# Altium schematic sheet FPGA_Banks_GTH.SchDoc: =ProjectName
size 420 x 297 mm; Author: T.P.; CompanyName: WUT; DrawnBy: T.P.; Organization: WUT ISE; Address1: Warsaw Univeristy of Technology; Address2: Nowowiejska 15/19; DocumentNumber: 10; Revision: 0.9; SheetNumber: 10; SheetTotal: 36; EDA_Number: ARTIQ; Projet: ARTIQ/SINARA; ModifiedBy: -; CreateDate: XX/XX/XXXX; CheckedDate: -; Title2: FPGA_Banks_GTH.SchDoc; DivGrp: ISE; Designer: G.K. and T.P.; ModifiedDate: -; ProjectName: ADC/DAC MEZZANINE
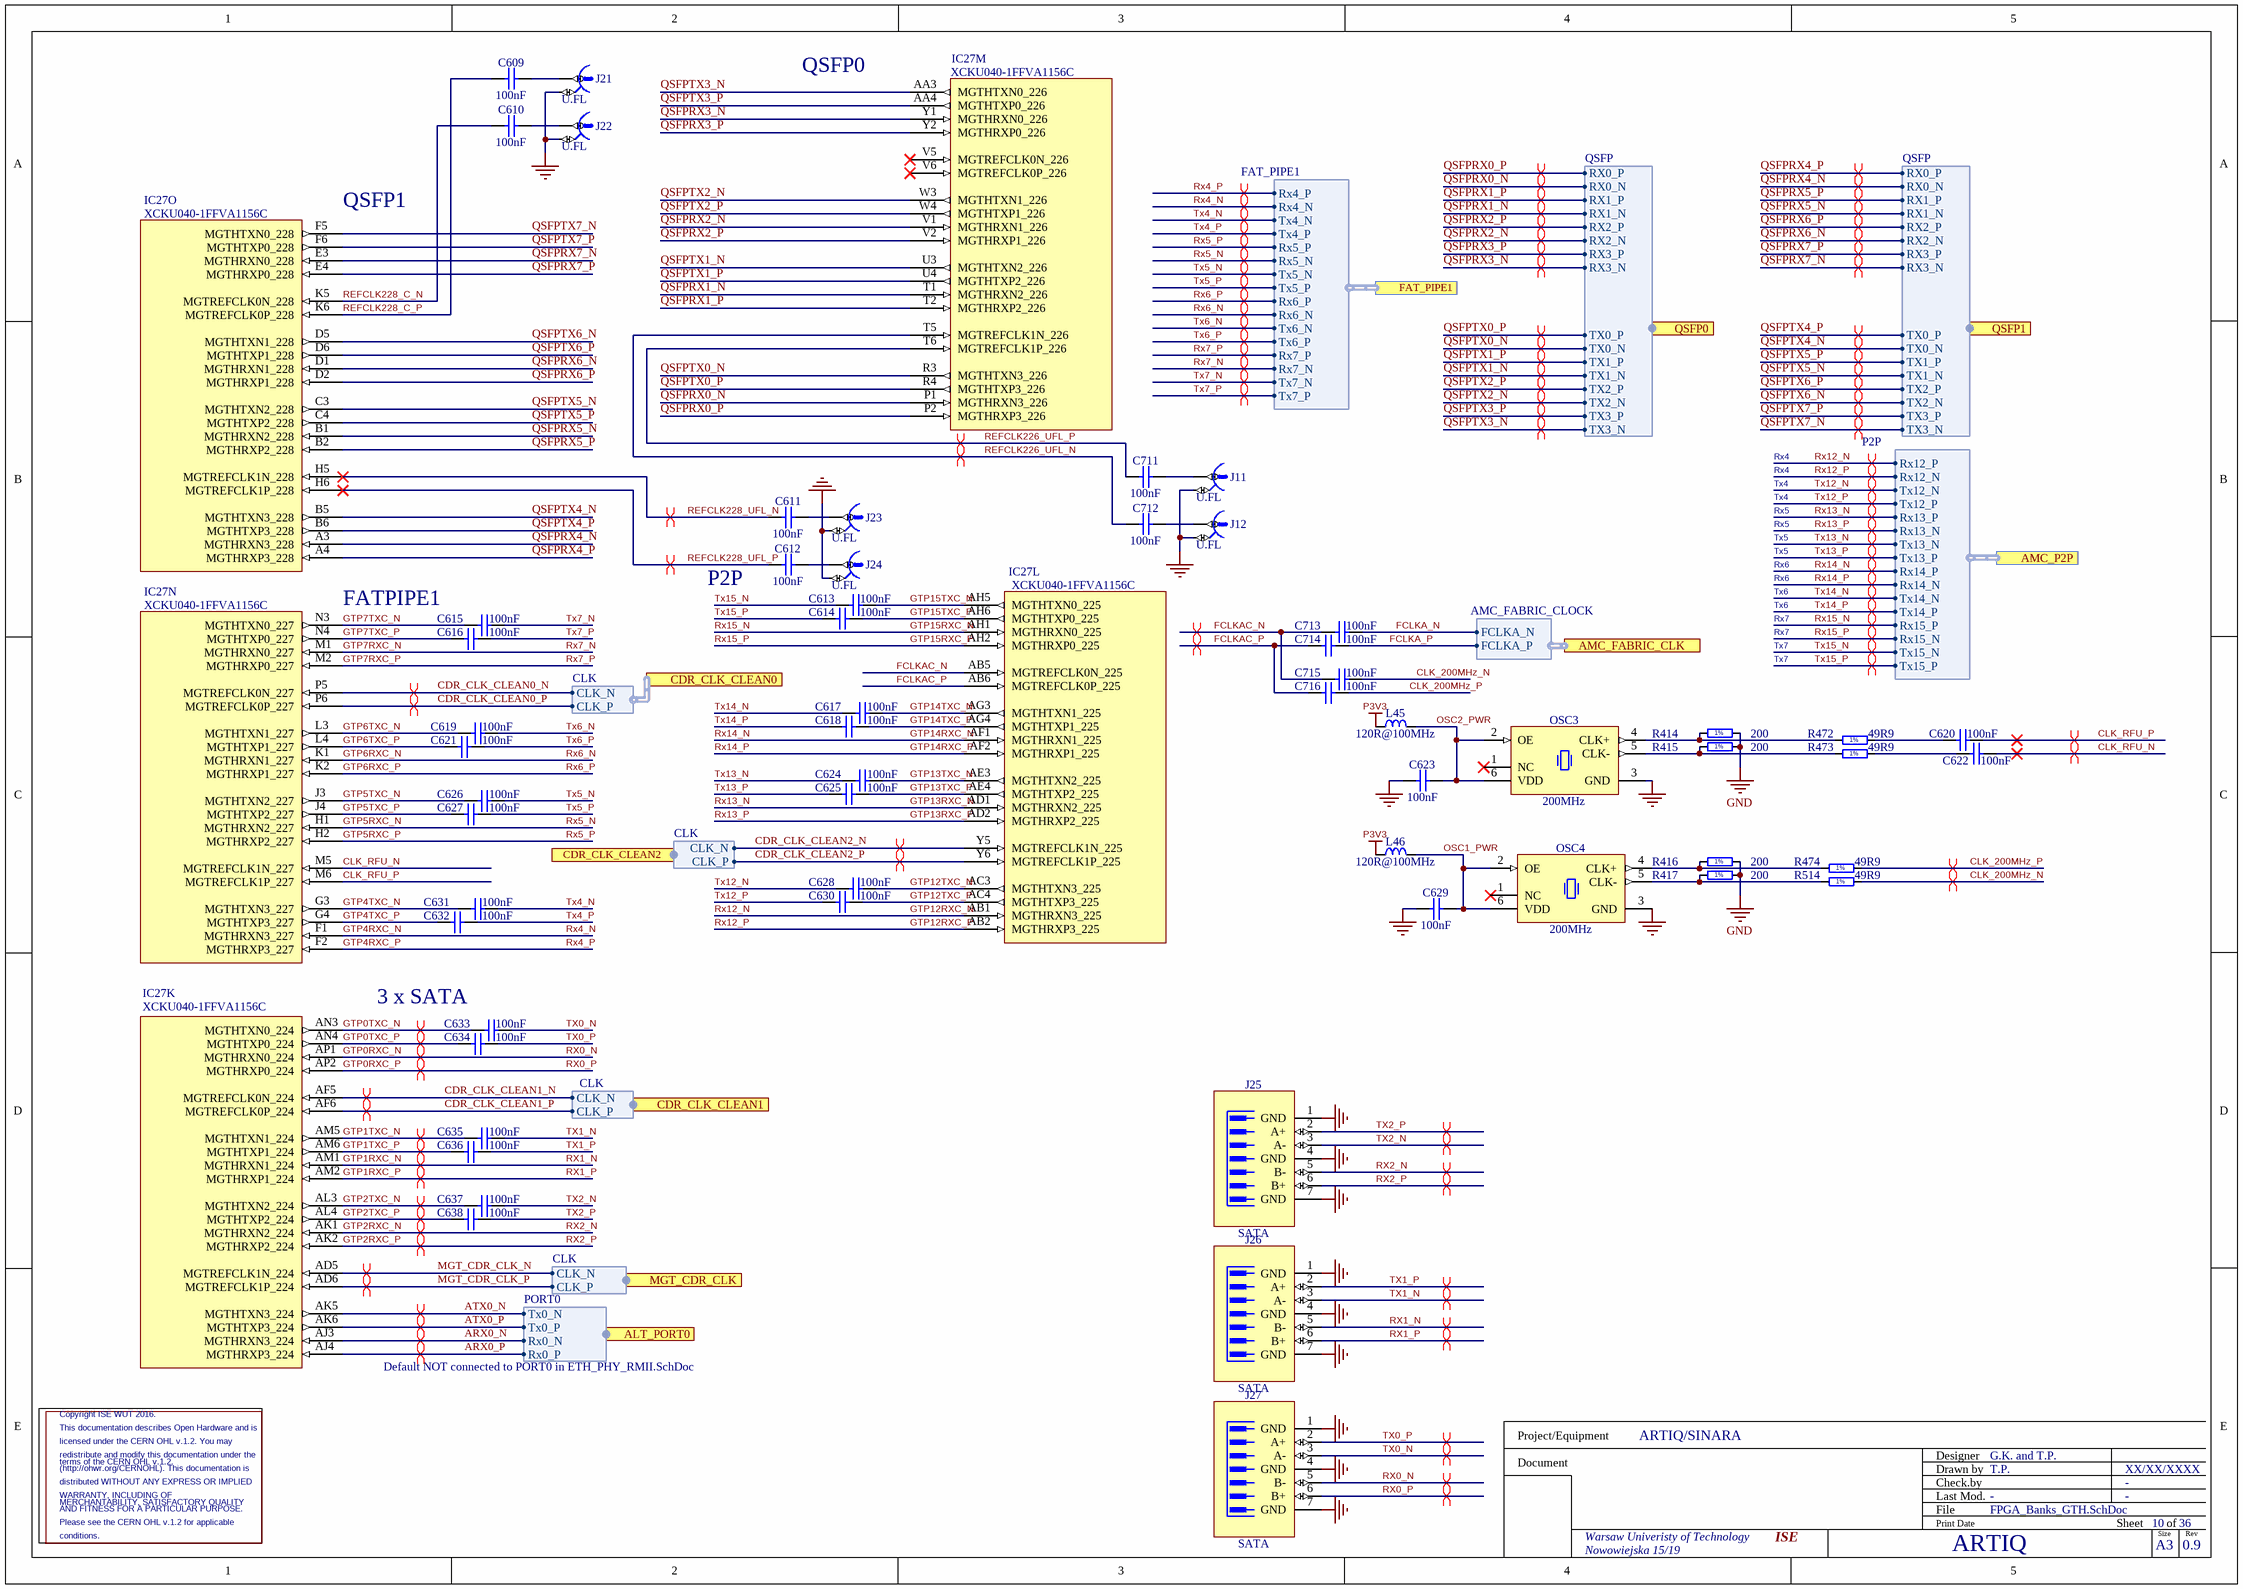
[diagram p0: FPGA_Banks_GTH.SchDoc]

## Parts
C609  100nF  [CAPC0603X33N]
C610  100nF  [CAPC0603X33N]
C611  100nF  [CAPC0603X33N]
C612  100nF  [CAPC0603X33N]
C613  100nF  [CAPC0603X33N]
C614  100nF  [CAPC0603X33N]
C615  100nF  [CAPC0603X33N]
C616  100nF  [CAPC0603X33N]
C617  100nF  [CAPC0603X33N]
C618  100nF  [CAPC0603X33N]
C619  100nF  [CAPC0603X33N]
C620  100nF  [CAPC0603X33N]
C621  100nF  [CAPC0603X33N]
C622  100nF  [CAPC0603X33N]
C623  100nF  [CAPC0603X33N]
C624  100nF  [CAPC0603X33N]
C625  100nF  [CAPC0603X33N]
C626  100nF  [CAPC0603X33N]
C627  100nF  [CAPC0603X33N]
C628  100nF  [CAPC0603X33N]
C629  100nF  [CAPC0603X33N]
C630  100nF  [CAPC0603X33N]
C631  100nF  [CAPC0603X33N]
C632  100nF  [CAPC0603X33N]
C633  100nF  [CAPC0603X33N]
C634  100nF  [CAPC0603X33N]
C635  100nF  [CAPC0603X33N]
C636  100nF  [CAPC0603X33N]
C637  100nF  [CAPC0603X33N]
C638  100nF  [CAPC0603X33N]
C711  100nF  [CAPC0603X33N]
C712  100nF  [CAPC0603X33N]
C713  100nF  [CAPC0603X33N]
C714  100nF  [CAPC0603X33N]
C715  100nF  [CAPC0603X33N]
C716  100nF  [CAPC0603X33N]
IC27  XCKU040-1FFVA1156C  [BGA1156C100P34X34_3500X3500X350]  (parts K,L,M,N,O of 22)
J11  U.FL  [HIROSE_U.FL-R-SMT-1(10)]
J12  U.FL  [HIROSE_U.FL-R-SMT-1(10)]
J21  U.FL  [HIROSE_U.FL-R-SMT-1(10)]
J22  U.FL  [HIROSE_U.FL-R-SMT-1(10)]
J23  U.FL  [HIROSE_U.FL-R-SMT-1(10)]
J24  U.FL  [HIROSE_U.FL-R-SMT-1(10)]
J25  SATA  [MOLEX_67800-5005]
J26  SATA  [MOLEX_67800-5005]
J27  SATA  [MOLEX_67800-5005]
L45  120R@100MHz  [INDC1005X55N]
L46  120R@100MHz  [INDC1005X55N]
OSC3  200MHz  [OSC_SILICON-LAB_SI510-6N(5X7)]
OSC4  200MHz  [OSC_SILICON-LAB_SI510-6N(5X7)]
R414  200  [RESC1005X40N]
R415  200  [RESC1005X40N]
R416  200  [RESC1005X40N]
R417  200  [RESC1005X40N]
R472  49R9  [RESC1005X40N]
R473  49R9  [RESC1005X40N]
R474  49R9  [RESC1005X40N]
R514  49R9  [RESC1005X40N]

## Ports
ALT_PORT0 (harness PORT0), AMC_FABRIC_CLK (harness AMC_FABRIC_CLOCK), AMC_P2P (harness P2P), CDR_CLK_CLEAN0 (harness CLK), CDR_CLK_CLEAN1 (harness CLK), CDR_CLK_CLEAN2 (harness CLK), FAT_PIPE1 (harness FAT_PIPE1), MGT_CDR_CLK (harness CLK), QSFP0 (harness QSFP), QSFP1 (harness QSFP)

## Harnesses
CLK: CLK_N, CLK_P
FAT_PIPE1: Rx4_P, Rx4_N, Tx4_N, Tx4_P, Rx5_P, Rx5_N, Tx5_N, Tx5_P, Rx6_P, Rx6_N, Tx6_N, Tx6_P, Rx7_P, Rx7_N, Tx7_N, Tx7_P
P2P: Rx12_P, Rx12_N, Tx12_N, Tx12_P, Rx13_P, Rx13_N, Tx13_N, Tx13_P, Rx14_P, Rx14_N, Tx14_N, Tx14_P, Rx15_P, Rx15_N, Tx15_N, Tx15_P
QSFP: RX0_P, RX0_N, RX1_P, RX1_N, RX2_P, RX2_N, RX3_P, RX3_N, TX0_P, TX0_N, TX1_P, TX1_N, TX2_P, TX2_N, TX3_P, TX3_N
PORT0: Rx0_P, Rx0_N, Tx0_N, Tx0_P
AMC_FABRIC_CLOCK: FCLKA_N, FCLKA_P

## Nets
GND: C623.1 C629.1 J11.2 J12.2 J21.2 J22.2 J23.2 J24.2 J25.1(GND) J25.4(GND) J25.7(GND) J26.1(GND) J26.4(GND) J26.7(GND) J27.1(GND) J27.4(GND) J27.7(GND) OSC3.3(GND) OSC4.3(GND) R414.2 R415.2 R416.2 R417.2
P3V3: L45.2 L46.2
ARX0_N: IC27.AJ3(MGTHRXN3_224) ; port ALT_PORT0.Rx0_N
ARX0_P: IC27.AJ4(MGTHRXP3_224) ; port ALT_PORT0.Rx0_P
ATX0_N: IC27.AK5(MGTHTXN3_224) ; port ALT_PORT0.Tx0_N
ATX0_P: IC27.AK6(MGTHTXP3_224) ; port ALT_PORT0.Tx0_P
CDR_CLK_CLEAN0_N: IC27.P5(MGTREFCLK0N_227) ; port CDR_CLK_CLEAN0.CLK_N
CDR_CLK_CLEAN0_P: IC27.P6(MGTREFCLK0P_227) ; port CDR_CLK_CLEAN0.CLK_P
CDR_CLK_CLEAN1_N: IC27.AF5(MGTREFCLK0N_224) ; port CDR_CLK_CLEAN1.CLK_N
CDR_CLK_CLEAN1_P: IC27.AF6(MGTREFCLK0P_224) ; port CDR_CLK_CLEAN1.CLK_P
CDR_CLK_CLEAN2_N: IC27.Y5(MGTREFCLK1N_225) ; port CDR_CLK_CLEAN2.CLK_N
CDR_CLK_CLEAN2_P: IC27.Y6(MGTREFCLK1P_225) ; port CDR_CLK_CLEAN2.CLK_P
CLK_200MHz_N: C715.2 R514.2
CLK_200MHz_P: C716.2 R474.2
CLK_RFU_N: C622.2 IC27.M5(MGTREFCLK1N_227)
CLK_RFU_P: C620.2 IC27.M6(MGTREFCLK1P_227)
FCLKA_N: C713.2 ; port AMC_FABRIC_CLK.FCLKA_N
FCLKA_P: C714.2 ; port AMC_FABRIC_CLK.FCLKA_P
FCLKAC_N: C713.1 C715.1 IC27.AB5(MGTREFCLK0N_225)
FCLKAC_P: C714.1 C716.1 IC27.AB6(MGTREFCLK0P_225)
GTP0RXC_N: IC27.AP1(MGTHRXN0_224) J27.5(B-)  [also labelled RX0_N]
GTP0RXC_P: IC27.AP2(MGTHRXP0_224) J27.6(B+)  [also labelled RX0_P]
GTP0TXC_N: C633.1 IC27.AN3(MGTHTXN0_224)
GTP0TXC_P: C634.1 IC27.AN4(MGTHTXP0_224)
GTP1RXC_N: IC27.AM1(MGTHRXN1_224) J26.5(B-)  [also labelled RX1_N]
GTP1RXC_P: IC27.AM2(MGTHRXP1_224) J26.6(B+)  [also labelled RX1_P]
GTP1TXC_N: C635.1 IC27.AM5(MGTHTXN1_224)
GTP1TXC_P: C636.1 IC27.AM6(MGTHTXP1_224)
GTP2RXC_N: IC27.AK1(MGTHRXN2_224) J25.5(B-)  [also labelled RX2_N]
GTP2RXC_P: IC27.AK2(MGTHRXP2_224) J25.6(B+)  [also labelled RX2_P]
GTP2TXC_N: C637.1 IC27.AL3(MGTHTXN2_224)
GTP2TXC_P: C638.1 IC27.AL4(MGTHTXP2_224)
GTP4RXC_N: IC27.F1(MGTHRXN3_227) ; port FAT_PIPE1.Rx4_N  [also labelled Rx4_N]
GTP4RXC_P: IC27.F2(MGTHRXP3_227) ; port FAT_PIPE1.Rx4_P  [also labelled Rx4_P]
GTP4TXC_N: C631.1 IC27.G3(MGTHTXN3_227)
GTP4TXC_P: C632.1 IC27.G4(MGTHTXP3_227)
GTP5RXC_N: IC27.H1(MGTHRXN2_227) ; port FAT_PIPE1.Rx5_N  [also labelled Rx5_N]
GTP5RXC_P: IC27.H2(MGTHRXP2_227) ; port FAT_PIPE1.Rx5_P  [also labelled Rx5_P]
GTP5TXC_N: C626.1 IC27.J3(MGTHTXN2_227)
GTP5TXC_P: C627.1 IC27.J4(MGTHTXP2_227)
GTP6RXC_N: IC27.K1(MGTHRXN1_227) ; port FAT_PIPE1.Rx6_N  [also labelled Rx6_N]
GTP6RXC_P: IC27.K2(MGTHRXP1_227) ; port FAT_PIPE1.Rx6_P  [also labelled Rx6_P]
GTP6TXC_N: C619.1 IC27.L3(MGTHTXN1_227)
GTP6TXC_P: C621.1 IC27.L4(MGTHTXP1_227)
GTP7RXC_N: IC27.M1(MGTHRXN0_227) ; port FAT_PIPE1.Rx7_N  [also labelled Rx7_N]
GTP7RXC_P: IC27.M2(MGTHRXP0_227) ; port FAT_PIPE1.Rx7_P  [also labelled Rx7_P]
GTP7TXC_N: C615.1 IC27.N3(MGTHTXN0_227)
GTP7TXC_P: C616.1 IC27.N4(MGTHTXP0_227)
GTP12RXC_N: IC27.AB1(MGTHRXN3_225) ; port AMC_P2P.Rx12_P  [also labelled Rx12_N]
GTP12RXC_P: IC27.AB2(MGTHRXP3_225) ; port AMC_P2P.Rx12_N  [also labelled Rx12_P]
GTP12TXC_N: C628.2 IC27.AC3(MGTHTXN3_225)
GTP12TXC_P: C630.2 IC27.AC4(MGTHTXP3_225)
GTP13RXC_N: IC27.AD1(MGTHRXN2_225) ; port AMC_P2P.Rx13_P  [also labelled Rx13_N]
GTP13RXC_P: IC27.AD2(MGTHRXP2_225) ; port AMC_P2P.Rx13_N  [also labelled Rx13_P]
GTP13TXC_N: C624.2 IC27.AE3(MGTHTXN2_225)
GTP13TXC_P: C625.2 IC27.AE4(MGTHTXP2_225)
GTP14RXC_N: IC27.AF1(MGTHRXN1_225) ; port AMC_P2P.Rx14_P  [also labelled Rx14_N]
GTP14RXC_P: IC27.AF2(MGTHRXP1_225) ; port AMC_P2P.Rx14_N  [also labelled Rx14_P]
GTP14TXC_N: C617.2 IC27.AG3(MGTHTXN1_225)
GTP14TXC_P: C618.2 IC27.AG4(MGTHTXP1_225)
GTP15RXC_N: IC27.AH1(MGTHRXN0_225) ; port AMC_P2P.Rx15_P  [also labelled Rx15_N]
GTP15RXC_P: IC27.AH2(MGTHRXP0_225) ; port AMC_P2P.Rx15_N  [also labelled Rx15_P]
GTP15TXC_N: C613.2 IC27.AH5(MGTHTXN0_225)
GTP15TXC_P: C614.2 IC27.AH6(MGTHTXP0_225)
MGT_CDR_CLK_N: IC27.AD5(MGTREFCLK1N_224) ; port MGT_CDR_CLK.CLK_N
MGT_CDR_CLK_P: IC27.AD6(MGTREFCLK1P_224) ; port MGT_CDR_CLK.CLK_P
OSC1_PWR: C629.2 L46.1 OSC4.2(OE) OSC4.6(VDD)
OSC2_PWR: C623.2 L45.1 OSC3.2(OE) OSC3.6(VDD)
QSFPRX0_N: IC27.P1(MGTHRXN3_226) ; port QSFP0.RX0_N
QSFPRX0_P: IC27.P2(MGTHRXP3_226) ; port QSFP0.RX0_P
QSFPRX1_N: IC27.T1(MGTHRXN2_226) ; port QSFP0.RX1_N
QSFPRX1_P: IC27.T2(MGTHRXP2_226) ; port QSFP0.RX1_P
QSFPRX2_N: IC27.V1(MGTHRXN1_226) ; port QSFP0.RX2_N
QSFPRX2_P: IC27.V2(MGTHRXP1_226) ; port QSFP0.RX2_P
QSFPRX3_N: IC27.Y1(MGTHRXN0_226) ; port QSFP0.RX3_N
QSFPRX3_P: IC27.Y2(MGTHRXP0_226) ; port QSFP0.RX3_P
QSFPRX4_N: IC27.A3(MGTHRXN3_228) ; port QSFP1.RX0_N
QSFPRX4_P: IC27.A4(MGTHRXP3_228) ; port QSFP1.RX0_P
QSFPRX5_N: IC27.B1(MGTHRXN2_228) ; port QSFP1.RX1_N
QSFPRX5_P: IC27.B2(MGTHRXP2_228) ; port QSFP1.RX1_P
QSFPRX6_N: IC27.D1(MGTHRXN1_228) ; port QSFP1.RX2_N
QSFPRX6_P: IC27.D2(MGTHRXP1_228) ; port QSFP1.RX2_P
QSFPRX7_N: IC27.E3(MGTHRXN0_228) ; port QSFP1.RX3_N
QSFPRX7_P: IC27.E4(MGTHRXP0_228) ; port QSFP1.RX3_P
QSFPTX0_N: IC27.R3(MGTHTXN3_226) ; port QSFP0.TX0_N
QSFPTX0_P: IC27.R4(MGTHTXP3_226) ; port QSFP0.TX0_P
QSFPTX1_N: IC27.U3(MGTHTXN2_226) ; port QSFP0.TX1_N
QSFPTX1_P: IC27.U4(MGTHTXP2_226) ; port QSFP0.TX1_P
QSFPTX2_N: IC27.W3(MGTHTXN1_226) ; port QSFP0.TX2_N
QSFPTX2_P: IC27.W4(MGTHTXP1_226) ; port QSFP0.TX2_P
QSFPTX3_N: IC27.AA3(MGTHTXN0_226) ; port QSFP0.TX3_N
QSFPTX3_P: IC27.AA4(MGTHTXP0_226) ; port QSFP0.TX3_P
QSFPTX4_N: IC27.B5(MGTHTXN3_228) ; port QSFP1.TX0_N
QSFPTX4_P: IC27.B6(MGTHTXP3_228) ; port QSFP1.TX0_P
QSFPTX5_N: IC27.C3(MGTHTXN2_228) ; port QSFP1.TX1_N
QSFPTX5_P: IC27.C4(MGTHTXP2_228) ; port QSFP1.TX1_P
QSFPTX6_N: IC27.D5(MGTHTXN1_228) ; port QSFP1.TX2_N
QSFPTX6_P: IC27.D6(MGTHTXP1_228) ; port QSFP1.TX2_P
QSFPTX7_N: IC27.F5(MGTHTXN0_228) ; port QSFP1.TX3_N
QSFPTX7_P: IC27.F6(MGTHTXP0_228) ; port QSFP1.TX3_P
REFCLK226_UFL_N: C712.1 IC27.T5(MGTREFCLK1N_226)
REFCLK226_UFL_P: C711.1 IC27.T6(MGTREFCLK1P_226)
REFCLK228_C_N: C610.1 IC27.K5(MGTREFCLK0N_228)
REFCLK228_C_P: C609.1 IC27.K6(MGTREFCLK0P_228)
REFCLK228_UFL_N: C611.1 IC27.H5(MGTREFCLK1N_228)
REFCLK228_UFL_P: C612.1 IC27.H6(MGTREFCLK1P_228)
TX0_N: C633.2 J27.3(A-)
TX0_P: C634.2 J27.2(A+)
TX1_N: C635.2 J26.3(A-)
TX1_P: C636.2 J26.2(A+)
TX2_N: C637.2 J25.3(A-)
TX2_P: C638.2 J25.2(A+)
Tx4_N: C631.2 ; port FAT_PIPE1.Tx4_N
Tx4_P: C632.2 ; port FAT_PIPE1.Tx4_P
Tx5_N: C626.2 ; port FAT_PIPE1.Tx5_N
Tx5_P: C627.2 ; port FAT_PIPE1.Tx5_P
Tx6_N: C619.2 ; port FAT_PIPE1.Tx6_N
Tx6_P: C621.2 ; port FAT_PIPE1.Tx6_P
Tx7_N: C615.2 ; port FAT_PIPE1.Tx7_N
Tx7_P: C616.2 ; port FAT_PIPE1.Tx7_P
Tx12_N: C628.1 ; port AMC_P2P.Tx12_N
Tx12_P: C630.1 ; port AMC_P2P.Tx12_P
Tx13_N: C624.1 ; port AMC_P2P.Tx13_N
Tx13_P: C625.1 ; port AMC_P2P.Tx13_P
Tx14_N: C617.1 ; port AMC_P2P.Tx14_N
Tx14_P: C618.1 ; port AMC_P2P.Tx14_P
Tx15_N: C613.1 ; port AMC_P2P.Tx15_N
Tx15_P: C614.1 ; port AMC_P2P.Tx15_P
NetC609_2: C609.2 J21.1
NetC610_2: C610.2 J22.1
NetC611_2: C611.2 J23.1
NetC612_2: C612.2 J24.1
NetC620_1: C620.1 R472.2
NetC622_1: C622.1 R473.2
NetC711_2: C711.2 J11.1
NetC712_2: C712.2 J12.1
NetOSC3_4: OSC3.4(CLK+) R414.1 R472.1
NetOSC3_5: OSC3.5(CLK-) R415.1 R473.1
NetOSC4_4: OSC4.4(CLK+) R416.1 R474.1
NetOSC4_5: OSC4.5(CLK-) R417.1 R514.1

Not connected (* = marked no-connect by the designer): IC27 V5(MGTREFCLK0N_226)* V6(MGTREFCLK0P_226)*; OSC3 1(NC)*; OSC4 1(NC)*

## Layout directives
differential pair; differential pair class Diff_100Ohm: ARX0_N, ARX0_P, ATX0_N, ATX0_P, CDR_CLK_CLEAN0_N, CDR_CLK_CLEAN0_P, CDR_CLK_CLEAN1_N, CDR_CLK_CLEAN1_P, CDR_CLK_CLEAN2_N, CDR_CLK_CLEAN2_P, FCLKAC_N, FCLKAC_P, GTP0RXC_N, GTP0RXC_P, GTP0TXC_N, GTP0TXC_P, GTP1RXC_N, GTP1RXC_P, GTP1TXC_N, GTP1TXC_P, GTP2RXC_N, GTP2RXC_P, GTP2TXC_N, GTP2TXC_P, GTP4RXC_N, GTP4RXC_P, GTP5RXC_N, GTP5RXC_P, GTP6RXC_N, GTP6RXC_P, GTP7RXC_N, GTP7RXC_P, GTP12RXC_N, GTP12RXC_P, GTP13RXC_N, GTP13RXC_P, GTP14RXC_N, GTP14RXC_P, GTP15RXC_N, GTP15RXC_P, MGT_CDR_CLK_N, MGT_CDR_CLK_P, QSFPRX0_N, QSFPRX0_P, QSFPRX1_N, QSFPRX1_P, QSFPRX2_N, QSFPRX2_P, QSFPRX3_N, QSFPRX3_P, QSFPRX4_N, QSFPRX4_P, QSFPRX5_N, QSFPRX5_P, QSFPRX6_N, QSFPRX6_P, QSFPRX7_N, QSFPRX7_P, QSFPTX0_N, QSFPTX0_P, QSFPTX1_N, QSFPTX1_P, QSFPTX2_N, QSFPTX2_P, QSFPTX3_N, QSFPTX3_P, QSFPTX4_N, QSFPTX4_P, QSFPTX5_N, QSFPTX5_P, QSFPTX6_N, QSFPTX6_P, QSFPTX7_N, QSFPTX7_P, REFCLK226_UFL_N, REFCLK226_UFL_P, REFCLK228_UFL_N, REFCLK228_UFL_P, TX0_N, TX0_P, TX1_N, TX1_P, TX2_N, TX2_P, Tx4_N, Tx4_P, Tx5_N, Tx5_P, Tx6_N, Tx6_P, Tx7_N, Tx7_P, Tx12_N, Tx12_P, Tx13_N, Tx13_P, Tx14_N, Tx14_P, Tx15_N, Tx15_P
differential pair; differential pair class LVPECL: CLK_200MHz_N, CLK_200MHz_P, CLK_RFU_N, CLK_RFU_P

## Notes on the sheet
- QSFP0
- (near IC27) QSFP1
- Rx4
- Tx4
- Rx5
- P2P
- Tx6
- Tx5
- Rx6
- FATPIPE1
- Tx7
- Rx7
- 3 x SATA
- Copyright ISE WUT 2016.
- Default NOT connected to PORT0 in ETH_PHY_RMII.SchDoc
- redistribute and modify this documentation under the
- distributed WITHOUT ANY EXPRESS OR IMPLIED
- licensed under the CERN OHL v.1.2. You may
- (http://ohwr.org/CERNOHL). This documentation is
- terms of the CERN OHL v.1.2.
- This documentation describes Open Hardware and is
- conditions.
- Please see the CERN OHL v.1.2 for applicable
- AND FITNESS FOR A PARTICULAR PURPOSE.
- WARRANTY, INCLUDING OF
- MERCHANTABILITY, SATISFACTORY QUALITY
- Project/Equipment
- Document
- Designer
- Drawn by
- Check.by
- File
- Last Mod.
- Print Date
- Sheet
- Size
- A3
- of
- Rev
- (in symbol R0402_49R9_1%_0.0625W_100PPM) 1%
- (in symbol R0402_200R_1%_0.0625W_100PPM) 1%

## Library data of the parts
C609-C638 C711-C716 = CC0201_100NF_6.3V_10%_X5R: Non-polarised capacitor; Manufacturer: GENERIC; Part Description: SMD Multilayer Chip Ceramic Capacitor; Manufacturer1 Part Number: 02016D104KAT2A; Tolerance: ±10%; Voltage: 6.3V; TC: X5R; Manufacturer Part Number: CC0201_100NF_6.3V_10%_X5R; Part Number: CC0201_100NF_6.3V_10%_X5R; Value: 100nF; Component Kind: Standard; Component Type: Standard; Pin Count: 2; Status: Not Recommended; Case: 0201; Mounted: Yes; Socket: No; SMD: Yes; Sense: No; Manufacturer1 Example: AVX; Manufacturer1 ComponentHeight: 0.33mm; HelpURL: \\cern.ch\dfs\Applications\Altium\Datasheets\CC0201_X5R_AVX.pdf; Author: CERN DEM JLC; CreateDate: 03.12.2007; LatestRevisionDate: 03.12.2007
IC27 = XCKU040-1FFVA1156C: Kintex UltraScale FPGA, 520 I/O, 530K Cells, 1156-Ball BGA, Speed Grade 1, Commercial Grade; Manufacturer: XILINX; Part Description: Kintex UltraScale, 40 DLL I/O, 416 HP I/O, 104 HR I/O, 1156-Pin BGA, Speed Grade 1, Commercial Grade; PressFit: No; Bonding: No; Manufacturer Part Number: XCKU040-1FFVA1156C; PackageDescription: BGA, 1.00mm Pitch, Square; 1156 Pin, 34 Columns X 34 Rows, Body 35.00mm X 35.00mm X 3.50mm H, IPC Medium Density; Part Number: XCKU040-1FFVA1156C; Component Kind: Standard; Component Type: Standard; Device: XCKU040-1FFVA1156C; Pin Count: 1156; Case: BGA1156; Mounted: Yes; Socket: No; SMD: Yes; Sense: No; ComponentHeight: 3.5mm; HelpURL: \\cern.ch\dfs\Applications\Altium\Datasheets\XCKU040-1FFVA1156C.pdf; ComponentLink1URL: \\cern.ch\dfs\Applications\Altium\Datasheets\XCKU040-1FFVA1156C_Package-Pinout.pdf; ComponentLink1Description: Package/Pinout; Author: CERN DEM CA; CreateDate: 16.08.2016; LatestRevisionDate: 16.08.2016
J11 J12 J21-J24 = HIROSE_U.FL-R-SMT-1(10): Manufacturer: HIROSE (HRS); Part Description: Up to 6GHz Ultra Small Surface Mount Male Coaxial Connectors U.FL Series; PressFit: No; Manufacturer Part Number: U.FL-R-SMT-1(10); Part Number: HIROSE_U.FL-R-SMT-1(10); Component Kind: Standard; Component Type: Standard; Pin Count: 2; Family: U.FL; Mounted: Yes; Socket: No; SMD: Yes; Sense: No; Status: None; ComponentHeight: 1.25mm; HelpURL: \\cern.ch\dfs\Applications\Altium\Datasheets\HIROSE_U.FL-R-SMT-1(10).pdf; Author: CERN DEM JLC; CreateDate: 24.03.2010; LatestRevisionDate: 24.03.2010
J25-J27 = MOLEX_67800-5005: 7 Pin SATA Receptacle; Manufacturer: MOLEX; Part Description: 1.27mm Pitch, 7 Contacts, Serial ATA High Speed Header, Straight with Locking Latch; PressFit: No; Manufacturer Part Number: 67800-5005; Part Number: MOLEX_67800-5005; Component Kind: Standard; Component Type: Standard; Pin Count: 7; Family: SATA; Mounted: Yes; Socket: No; SMD: Yes; Sense: No; Status: None; ComponentHeight: 8.4mm; HelpURL: \\cern.ch\dfs\Applications\Altium\Datasheets\MOLEX_67800-5005.pdf; Author: CERN DEM MR; CreateDate: 01.12.2016; LatestRevisionDate: 01.12.2016
L45 L46 = IND0402_MURATA_BLM15PX121SN1D: Inductor; Manufacturer: MURATA; Part Description: SMD EMIFIL Chip Ferrite Bead; Tolerance: ±25%; Power: 2A; Resistance: 0.055R; Manufacturer Part Number: BLM15PX121SN1D; Part Number: IND0402_MURATA_BLM15PX121SN1D; Value: 120R@100MHz; Component Kind: Standard; Component Type: Standard; Pin Count: 2; Status: None; Case: 0402; Mounted: Yes; Socket: No; SMD: Yes; Sense: No; ComponentHeight: 0.55mm; HelpURL: \\cern.ch\dfs\Applications\Altium\Datasheets\IND0402_MURATA_BLM15PX.pdf; Author: CERN DEM JMW; CreateDate: 19.02.2014; LatestRevisionDate: 19.02.2014
OSC3 OSC4 = OSC_200MHZ_SILICON-LAB_510ABA200M000AAG: Crystal Oscillator 6 pins, Si510 (LVDS/LVPECL/HCSL/Dual CMOS); Part Description: 3.3V ±25ppm LVPECL Crystal Oscillator (XO), Si510 Series; Manufacturer: SILICON LABS; Autho: T.P.; PressFit: No; Bonding: No; Manufacturer Part Number: 510ABA200M000AAG; Mounted: Yes; PackageDescription: Oscillator Si510 Series, 6 pins, 5x7mm; Part Number: OSC_200MHZ_SILICON-LAB_510ABA200M000AAG; Pin Count: 6; Sense: No; Component Kind: Standard; Component Type: Standard; ComponentHeight: 1.8mm; CreateDate: 22.01.2019; SMD: Yes; Value: 200MHz; Socket: No
R414-R417 = R0402_200R_1%_0.0625W_100PPM: Resistor - 1%; Manufacturer: GENERIC; Part Description: General Purpose Thick Film Chip Resistor; Manufacturer1 Part Number: 232270672001L; TC: ±100ppm/°C; PressFit: No; Manufacturer Part Number: R0402_200R_1%_0.0625W_100PPM; Part Number: R0402_200R_1%_0.0625W_100PPM; Tolerance: ±1%; Value: 200; Component Kind: Standard; Component Type: Standard; Pin Count: 2; Status: Not Recommended; Power: 0.0625W; Case: 0402; Mounted: Yes; Sense: No; Socket: No; SMD: Yes; Manufacturer1 Example: YAGEO PHYCOMP; Manufacturer1 ComponentHeight: 0.4mm; HelpURL: \\cern.ch\dfs\Applications\Altium\Datasheets\R0402_Phycomp_RC0402.pdf; Author: CERN DEM JLC; CreateDate: 03.12.2007; LatestRevisionDate: 17.10.2012
R472-R474 R514 = R0402_49R9_1%_0.0625W_100PPM: Resistor - 1%; Manufacturer: GENERIC; Part Description: General Purpose Thick Film Chip Resistor; Manufacturer1 Part Number: 232270674999L or RC0402FR-0749R9L; TC: ±100ppm/°C; PressFit: No; Manufacturer Part Number: R0402_49R9_1%_0.0625W_100PPM; Part Number: R0402_49R9_1%_0.0625W_100PPM; Tolerance: ±1%; Value: 49R9; Component Kind: Standard; Component Type: Standard; Pin Count: 2; Status: Not Recommended; Power: 0.0625W; Case: 0402; Mounted: Yes; Sense: No; Socket: No; SMD: Yes; Manufacturer1 Example: YAGEO PHYCOMP; Manufacturer1 ComponentHeight: 0.4mm; HelpURL: \\cern.ch\dfs\Applications\Altium\Datasheets\R0402_Phycomp_RC0402.pdf; Author: CERN DEM JLC; CreateDate: 24.10.2012; LatestRevisionDate: 24.10.2012